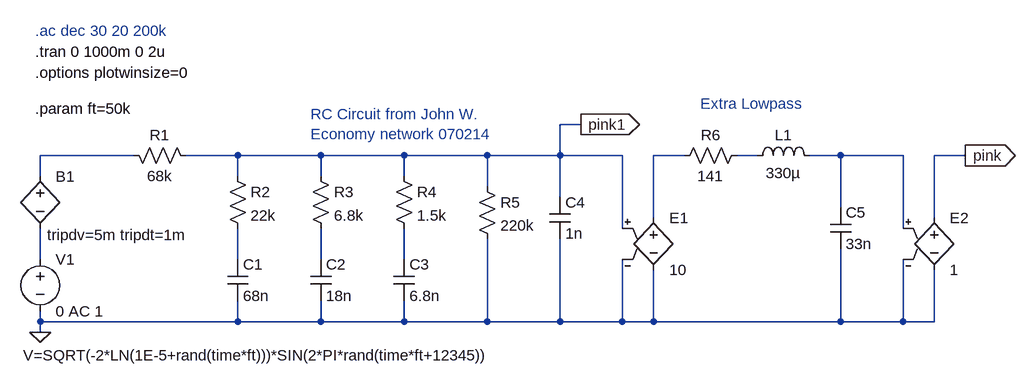
[diagram p0: schematic pink_gauss_noise.asc]
pink_gauss_noise.asc, the LTspice schematic file:
Version 4
SHEET 1 1368 804
WIRE 512 80 480 80
WIRE -176 128 -320 128
WIRE -16 128 -96 128
WIRE 112 128 -16 128
WIRE 240 128 112 128
WIRE 368 128 240 128
WIRE 480 128 480 80
WIRE 480 128 368 128
WIRE 576 128 480 128
WIRE 672 128 624 128
WIRE 784 128 752 128
WIRE 912 128 864 128
WIRE 1008 128 912 128
WIRE 1104 128 1056 128
WIRE -320 160 -320 128
WIRE -16 160 -16 128
WIRE 112 160 112 128
WIRE 240 160 240 128
WIRE 368 176 368 128
WIRE 480 192 480 128
WIRE 912 208 912 128
WIRE 624 224 624 128
WIRE 1056 224 1056 128
WIRE 576 240 576 128
WIRE 1008 240 1008 128
WIRE -320 288 -320 240
WIRE -16 288 -16 240
WIRE 112 288 112 240
WIRE 240 288 240 240
WIRE -320 384 -320 368
WIRE -16 384 -16 352
WIRE -16 384 -320 384
WIRE 112 384 112 352
WIRE 112 384 -16 384
WIRE 240 384 240 352
WIRE 240 384 112 384
WIRE 368 384 368 256
WIRE 368 384 240 384
WIRE 480 384 480 256
WIRE 480 384 368 384
WIRE 576 384 576 288
WIRE 576 384 480 384
WIRE 624 384 624 304
WIRE 624 384 576 384
WIRE 912 384 912 272
WIRE 912 384 624 384
WIRE 1008 384 1008 288
WIRE 1008 384 912 384
WIRE 1056 384 1056 304
WIRE 1056 384 1008 384
WIRE -320 400 -320 384
FLAG -320 400 0
FLAG 1104 128 pink
IOPIN 1104 128 Out
FLAG 512 80 pink1
IOPIN 512 80 Out
SYMBOL res -80 144 M270
WINDOW 0 32 56 VTop 2
WINDOW 3 0 56 VBottom 2
SYMATTR InstName R1
SYMATTR Value 68k
SYMBOL res -32 144 R0
SYMATTR InstName R2
SYMATTR Value 22k
SYMBOL res 96 144 R0
SYMATTR InstName R3
SYMATTR Value 6.8k
SYMBOL res 224 144 R0
SYMATTR InstName R4
SYMATTR Value 1.5k
SYMBOL cap -32 288 R0
SYMATTR InstName C1
SYMATTR Value 68n
SYMBOL cap 96 288 R0
SYMATTR InstName C2
SYMATTR Value 18n
SYMBOL cap 224 288 R0
SYMATTR InstName C3
SYMATTR Value 6.8n
SYMBOL res 352 160 R0
SYMATTR InstName R5
SYMATTR Value 220k
SYMBOL cap 464 192 R0
SYMATTR InstName C4
SYMATTR Value 1n
SYMBOL bv -320 144 R0
WINDOW 123 11 106 Left 2
WINDOW 3 -26 292 Left 2
SYMATTR Value2 tripdv=5m tripdt=1m
SYMATTR Value V=SQRT(-2*LN(1E-5+rand(time*ft)))*SIN(2*PI*rand(time*ft+12345))
SYMATTR InstName B1
SYMBOL voltage -320 272 R0
SYMATTR InstName V1
SYMATTR Value 0 AC 1
SYMBOL e 624 208 R0
SYMATTR InstName E1
SYMATTR Value 10
SYMBOL ind 768 144 R270
WINDOW 0 32 56 VTop 2
WINDOW 3 5 56 VBottom 2
SYMATTR InstName L1
SYMATTR Value 330µ
SYMBOL res 656 144 R270
WINDOW 0 32 56 VTop 2
WINDOW 3 0 56 VBottom 2
SYMATTR InstName R6
SYMATTR Value 141
SYMBOL cap 896 208 R0
SYMATTR InstName C5
SYMATTR Value 33n
SYMBOL e 1056 208 R0
SYMATTR InstName E2
SYMATTR Value 1
TEXT -328 -64 Left 2 ;.ac dec 30 20 200k
TEXT 96 64 Left 2 ;RC Circuit from John W.\nEconomy network 070214
TEXT -328 56 Left 2 !.param ft=50k
TEXT -328 -32 Left 2 !.tran 0 1000m 0 2u
TEXT -328 0 Left 2 !.options plotwinsize=0
TEXT 696 48 Left 2 ;Extra Lowpass

The netlist it stands for:
* pink_gauss_noise.asc
R1 pink1 N001 68k
R2 pink1 N006 22k
R3 pink1 N007 6.8k
R4 pink1 N008 1.5k
C1 N006 0 68n
C2 N007 0 18n
C3 N008 0 6.8n
R5 pink1 0 220k
C4 pink1 0 1n
B1 N001 N005 V=SQRT(-2*LN(1E-5+rand(time*ft)))*SIN(2*PI*rand(time*ft+12345)) tripdv=5m tripdt=1m
V1 N005 0 0 AC 1
E1 N002 0 pink1 0 10
L1 N003 N004 330µ
R6 N002 N003 141
C5 N004 0 33n
E2 pink 0 N004 0 1
* .ac dec 30 20 200k
* RC Circuit from John W.
* Economy network 070214
.param ft=50k
.tran 0 1000m 0 2u
.options plotwinsize=0
* Extra Lowpass
.backanno
.end